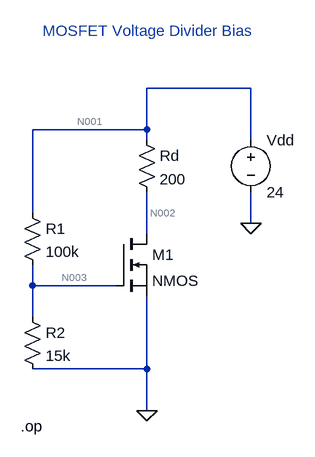
[diagram p0: schematic Draft1.asc]
Draft1.asc, the LTspice schematic file:
Version 4
SHEET 1 880 680
WIRE 400 -128 240 -128
WIRE 240 -64 240 -128
WIRE 240 -64 64 -64
WIRE 240 -48 240 -64
WIRE 400 -48 400 -128
WIRE 64 64 64 -64
WIRE 400 80 400 32
WIRE 240 96 240 32
WIRE 64 176 64 144
WIRE 192 176 64 176
WIRE 64 224 64 176
WIRE 240 304 240 192
WIRE 240 304 64 304
WIRE 240 368 240 304
FLAG 240 368 0
FLAG 400 80 0
SYMBOL res 48 48 R0
SYMATTR InstName R1
SYMATTR Value 100k
SYMBOL res 48 208 R0
SYMATTR InstName R2
SYMATTR Value 15k
SYMBOL res 224 -64 R0
SYMATTR InstName Rd
SYMATTR Value 200
SYMBOL voltage 400 -64 R0
WINDOW 123 0 0 Left 0
WINDOW 39 0 0 Left 0
SYMATTR InstName Vdd
SYMATTR Value 24
SYMBOL nmos 192 96 R0
SYMATTR InstName M1
TEXT 46 392 Left 2 !.op
TEXT 80 -216 Left 2 ;MOSFET Voltage Divider Bias

The netlist it stands for:
* Draft1.asc
R1 N001 N003 100k
R2 N003 0 15k
Rd N001 N002 200
Vdd N001 0 24
M1 N002 N003 0 0 NMOS
.model NMOS NMOS
.model PMOS PMOS
.lib standard.mos
.op
* MOSFET Voltage Divider Bias
.backanno
.end

* Results of the author's LTspice run, read from the files saved beside the schematic
* Operating Point:
*   V(n001) = 24 V
*   V(n003) = 3.13 V
*   V(n002) = 23.98 V
*   Id(M1) = 98 µA
*   Ig(M1) = 0 A
*   Ib(M1) = -23.99 pA
*   Is(M1) = -98 µA
*   I(Rd) = 98 µA
*   I(R2) = 208.7 µA
*   I(R1) = 208.7 µA
*   I(Vdd) = -306.7 µA
* From the log:
*   Semiconductor Device Operating Points:
*                           --- MOSFET Transistors ---
*   Name:          m1
*   Model:        nmos
*   Id:          9.80e-05
*   Vgs:         3.13e+00
*   Vds:         2.40e+01
*   Vbs:         0.00e+00
*   Vth:         0.00e+00
*   Vdsat:       3.13e+00
*   Gm:          6.26e-05
*   Gds:         0.00e+00
*   Gmb:         0.00e+00
*   Cbd:         0.00e+00
*   Cbs:         0.00e+00
*   Cgsov:       0.00e+00
*   Cgdov:       0.00e+00
*   Cgbov:       0.00e+00
*   Cgs:         0.00e+00
*   Cgd:         0.00e+00
*   Cgb:         0.00e+00